# EAGLE schematic DWM_shield (EAGLE 9.1.3)
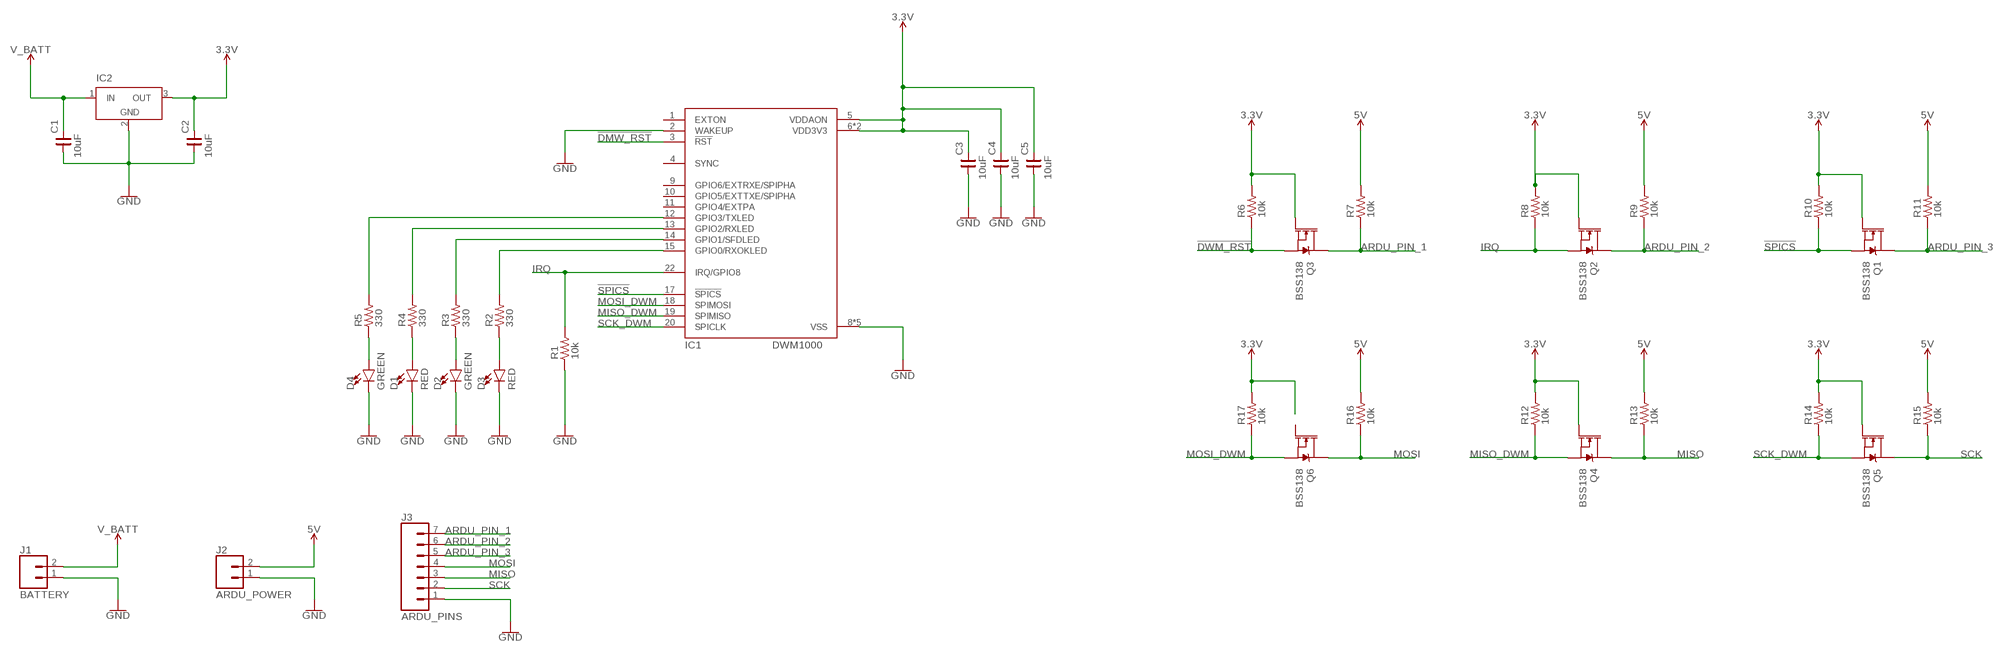
[diagram p0: schematic, sheet 1]

## Parts
C1  10uF  C_1206  [C1206]
C2  10uF  C_1206  [C1206]
C3  10uF  C_1206  [C1206]
C4  10uF  C_1206  [C1206]
C5  10uF  C_1206  [C1206]
D1  RED  LED-RED1206  [LED-1206]
D2  GREEN  LED-GREEN1206  [LED-1206]
D3  RED  LED-RED1206  [LED-1206]
D4  GREEN  LED-GREEN1206  [LED-1206]
IC1  DWM1000  [DWM1000]
IC2  LT1129CST5  [SOT223]
J1  BATTERY  CONN_02LOCK_LONGPADS  [1X02_LOCK_LONGPADS]
J2  ARDU_POWER  CONN_02LOCK_LONGPADS  [1X02_LOCK_LONGPADS]
J3  ARDU_PINS  CONN_07LONGPADS  [1X07_LONGPADS]
Q1  BSS138  MOSFET-NCH-AO3404A  [SOT23-3]
Q2  BSS138  MOSFET-NCH-AO3404A  [SOT23-3]
Q3  BSS138  MOSFET-NCH-AO3404A  [SOT23-3]
Q4  BSS138  MOSFET-NCH-AO3404A  [SOT23-3]
Q5  BSS138  MOSFET-NCH-AO3404A  [SOT23-3]
Q6  BSS138  MOSFET-NCH-AO3404A  [SOT23-3]
R1  10k  R_1206  [R1206]
R2  330  R_1206  [R1206]
R3  330  R_1206  [R1206]
R4  330  R_1206  [R1206]
R5  330  R_1206  [R1206]
R6  10k  R_1206  [R1206]
R7  10k  R_1206  [R1206]
R8  10k  R_1206  [R1206]
R9  10k  R_1206  [R1206]
R10  10k  R_1206  [R1206]
R11  10k  R_1206  [R1206]
R12  10k  R_1206  [R1206]
R13  10k  R_1206  [R1206]
R14  10k  R_1206  [R1206]
R15  10k  R_1206  [R1206]
R16  10k  R_1206  [R1206]
R17  10k  R_1206  [R1206]

## Nets
3.3V: C2.2 C3.2 C4.2 C5.2 IC1.5(VDDAON) IC1.6(VDD3V3) IC1.7(VDD3V3) IC2.3(OUT) Q1.1(G) Q2.1(G) Q3.1(G) Q4.1(G) Q5.1(G) R6.2 R8.2 R10.2 R12.2 R14.2 R17.2
5V: J2.2 R7.2 R9.2 R11.2 R13.2 R15.2 R16.2
!DMW_RST: IC1.3(!RST)
!DWM_RST: Q3.2(S) R6.1
!SPICS: IC1.17(!SPICS) Q1.2(S) R10.1
ARDU_PIN_1: J3.7 Q3.3(D) R7.1
ARDU_PIN_2: J3.6 Q2.3(D) R9.1
ARDU_PIN_3: J3.5 Q1.3(D) R11.1
GND: C1.1 C2.1 C3.1 C4.1 C5.1 D1.C D2.C D3.C D4.C IC1.2(WAKEUP) IC1.8(VSS) IC1.16(VSS) IC1.21(VSS) IC1.23(VSS) IC1.24(VSS) IC2.2(GND) J1.1 J2.1 J3.1 R1.1
IRQ: IC1.22(IRQ/GPIO8) Q2.2(S) R1.2 R8.1
MISO: J3.3 Q4.3(D) R13.1
MISO_DWM: IC1.19(SPIMISO) Q4.2(S) R12.1
MOSI: J3.4 Q6.3(D) R16.1
MOSI_DWM: IC1.18(SPIMOSI) Q6.2(S) R17.1
N$1: IC1.15(GPIO0/RXOKLED) R2.2
N$2: IC1.14(GPIO1/SFDLED) R3.2
N$3: D4.A R5.1
N$4: IC1.13(GPIO2/RXLED) R4.2
N$5: IC1.12(GPIO3/TXLED) R5.2
N$6: D2.A R3.1
N$9: D1.A R4.1
N$12: D3.A R2.1
SCK: J3.2 Q5.3(D) R15.1
SCK_DWM: IC1.20(SPICLK) Q5.2(S) R14.1
VCC: C1.2 IC2.1(IN) J1.2 ; supply symbol labelled V_BATT
Unconnected: IC1.1(EXTON) IC1.4(SYNC) IC1.9(GPIO6/EXTRXE/SPIPHA) IC1.10(GPIO5/EXTTXE/SPIPHA) IC1.11(GPIO4/EXTPA) Q6.1(G)

## Power pins joined to a net without a drawn wire
GND: IC2.4(GND)

## Library data of the parts
C1-C5 = rc-master-smd:C_: NON-POLARIZED CAP
D1 D3 = SparkFun-LED:LED-RED: Red SMD LED Used in manufacturing of most products at SparkFun Packages: 0603 - SMD 0603 package [Product Link] <http://docs.avagotech.com/docs/AV02-0551EN> 0603 SMART - SMD 0603 SMART package ( more efficient and expensive)[Product Link] <http://www.osram-os.com/Graphics/XPic2/00077099_0.pdf> 1206 - SMD1206 package [Product Link] <https://www.sparkfun.com/datasheets/DevTools/LilyPad/Q150OVS4.pdff> SparkFun Products: Pro Mini 328 -5V <https://www.sparkfun.com/products/821> RedBoard <https://www.sparkfun.com/products/12757> IOIO-OTG <https://www.sparkfun.com/products/13613>; PROD_ID: DIO-09912
D2 D4 = SparkFun-LED:LED-GREEN: Green SMD LED Used in manufacturing of various products at SparkFun Packages: 0603 - SMD 0603 package [Product Link] <http://www.futureelectronics.com/en/technologies/semiconductors/optoelectronics/leds/Pages/9894312-LTST-C190GKT.aspx?CrossPart=HSMG-C190&IM=0> LilyPad 1206 - SMD1206 LilyPad package [Product Link] <http://www.futureelectronics.com/en/Technologies/Product.aspx?ProductID=IN150NGHARVATEKCORPORATION2049943&IM=0> 1206 - SMD1206 package [Product Link] <http://www.futureelectronics.com/en/technologies/semiconductors/optoelectronics/leds/Pages/8315665-LTST-C150KGKT.aspx?IM=0> 1206 Bottom Mount -SMD 1206 Bottom Mount [Product Link] <http://www.digikey.com/product-detail/en/lite-on-inc/LTST-C230KGKT/160-1456-1-ND/386854> SparkFun Products: Pro Mini 328 -5V <https://www.sparkfun.com/products/821> RedBoard <https://www.sparkfun.com/products/12757> MP3 Trigger <https://www.sparkfun.com/products/13720> Makey Makey <https://www.sparkfun.com/products/11076>; PROD_ID: DIO-00862
IC1 = decawave:DWM1000
IC2 = linear-technology-3:LT1129CST5: VOLTAGE REGULATOR with shutdown
J1 J2 = SparkFun-Connectors:CONN_02: Multi connection point. Often used as Generic Header-pin footprint for 0.1 inch spaced/style header connections On any of the 0.1 inch spaced packages, you can populate with these: Break Away Headers - Straight <https://www.sparkfun.com/products/116> (PRT-00116) Break Away Male Headers - Right Angle <https://www.sparkfun.com/products/553> (PRT-00553) Female Headers <https://www.sparkfun.com/products/115> (PRT-00115) Break Away Headers - Machine Pin <https://www.sparkfun.com/products/117> (PRT-00117) Break Away Female Headers - Swiss Machine Pin <https://www.sparkfun.com/products/743> (PRT-00743) For SCREWTERMINALS and SPRING TERMINALS visit here: Screw Terimnals on SparkFun.com <https://www.sparkfun.com/search/results?term=Screw+Terminals> (5mm/3.5mm/2.54mm spacing) This device is also useful as a general connection point to wire up your design to another part of your project. Our various solder wires solder well into these plated through hole pads. Hook-Up Wire - Assortment (Stranded, 22 AWG) <https://www.sparkfun.com/products/11375> (PRT-11375) Hook-Up Wire - Assortment (Solid Core, 22 AWG) <https://www.sparkfun.com/products/11367> (PRT-11367) View the entire wire category on our website here <https://www.sparkfun.com/categories/141> Special notes: Molex polarized connector foot print use with: PRT-08233 with associated crimp pins and housings. 2.54_SCREWTERM for use with PRT-10571. 3.5mm Screw Terminal footprints for PRT-08084 5mm Screw Terminal footprints for use with PRT-08432
J3 = SparkFun-Connectors:CONN_07: Multi connection point. Often used as Generic Header-pin footprint for 0.1 inch spaced/style header connections On any of the 0.1 inch spaced packages, you can populate with these: Break Away Headers - Straight <https://www.sparkfun.com/products/116> (PRT-00116) Break Away Male Headers - Right Angle <https://www.sparkfun.com/products/553> (PRT-00553) Female Headers <https://www.sparkfun.com/products/115> (PRT-00115) Break Away Headers - Machine Pin <https://www.sparkfun.com/products/117> (PRT-00117) Break Away Female Headers - Swiss Machine Pin <https://www.sparkfun.com/products/743> (PRT-00743) For SCREWTERMINALS and SPRING TERMINALS visit here: Screw Terimnals on SparkFun.com <https://www.sparkfun.com/search/results?term=Screw+Terminals> (5mm/3.5mm/2.54mm spacing) This device is also useful as a general connection point to wire up your design to another part of your project. Our various solder wires solder well into these plated through hole pads. Hook-Up Wire - Assortment (Stranded, 22 AWG) <https://www.sparkfun.com/products/11375> (PRT-11375) Hook-Up Wire - Assortment (Solid Core, 22 AWG) <https://www.sparkfun.com/products/11367> (PRT-11367) View the entire wire category on our website here <https://www.sparkfun.com/categories/141> Special notes: Molex polarized connector foot print use with SKU : PRT-08231 with associated crimp pins and housings. 1MM SMD Version SKU: PRT-10208 NOTES ON THE VARIANTS LOCK and LOCK_LONGPADS... This footprint was designed to help hold the alignment of a through-hole component (i.e. 6-pin header) while soldering it into place. You may notice that each hole has been shifted either up or down by 0.005 of an inch from it's more standard position (which is a perfectly straight line). This slight alteration caused the pins (the squares in the middle) to touch the edges of the holes. Because they are alternating, it causes a "brace" to hold the component in place. 0.005 has proven to be the perfect amount of "off-center" position when using our standard breakaway headers. Although looks a little odd when you look at the bare footprint, once you have a header in there, the alteration is very hard to notice. Also,if you push a header all the way into place, it is covered up entirely on the bottom side.
Q1-Q6 = SparkFun-DiscreteSemi:MOSFET-NCH: N-channel MOSFETs Voltage controlled devices that allow control of high current outputs. SparkFun Products: SparkFun OpenScale <https://www.sparkfun.com/products/13261> SparkFun Digital Sandbox <https://www.sparkfun.com/products/12651> SparkFun Monster Moto Shield <https://www.sparkfun.com/products/10182> SparkFun MOSFET Power Controller <https://www.sparkfun.com/products/11214>; PROD_ID: TRANS-12988; VALUE: 5.8A/30V/35mΩ
R1-R17 = rc-master-smd:R_: RESISTOR